# EAGLE schematic master_jorge2 (EAGLE 7.1.0)
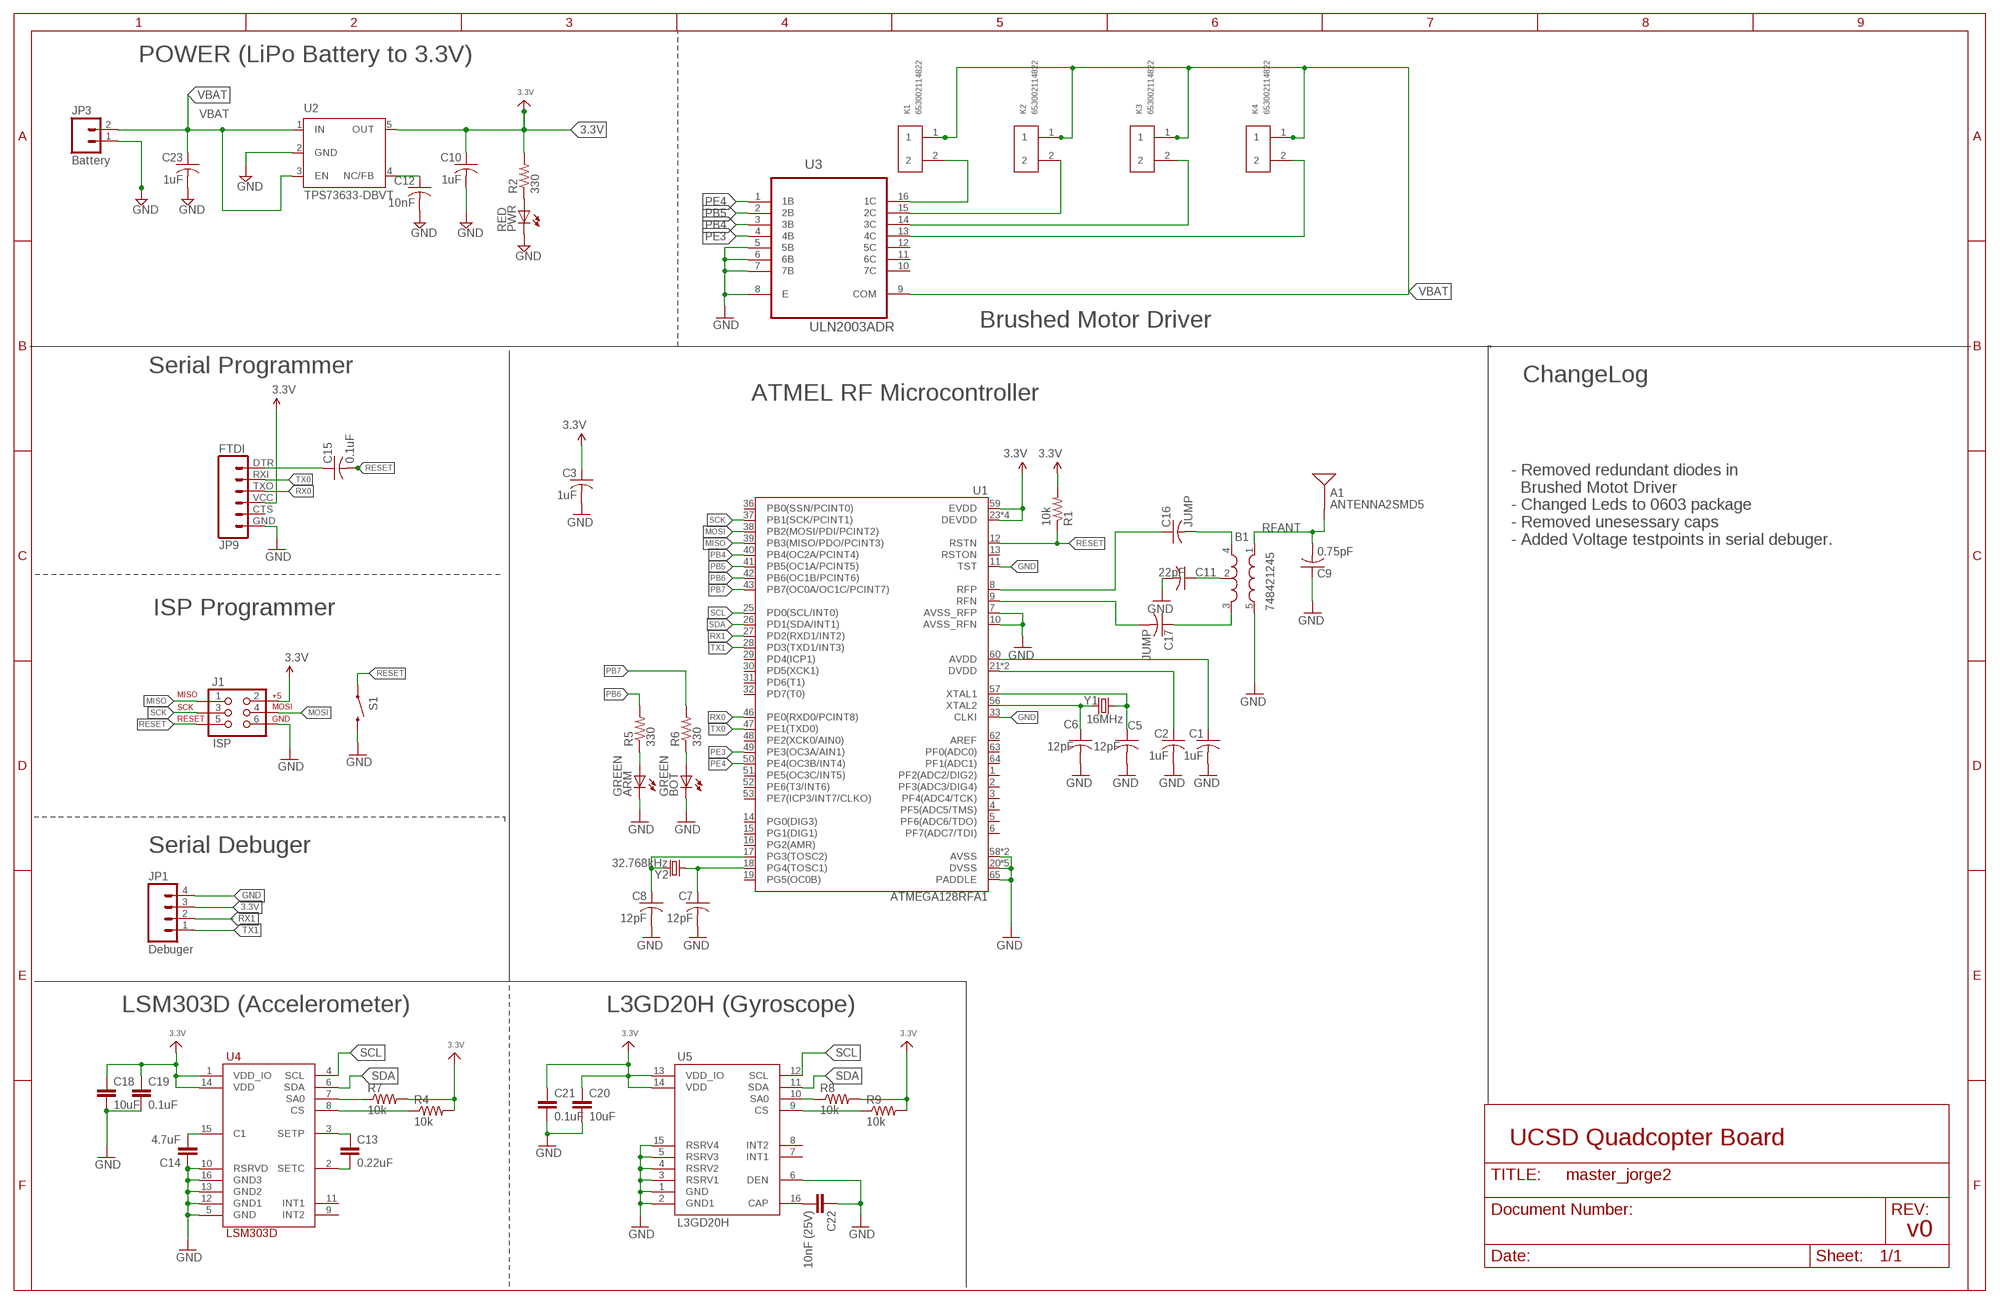
[diagram p0: schematic, sheet 1]

## Parts
A1  ANTENNA2SMD5  [ANTENNA-CHIP5]
ARM  GREEN  LEDCHIPLED_0603  [CHIPLED_0603]
B1  748421245  BALUN0805  [BALUN]
BOT  GREEN  LEDCHIPLED_0603  [CHIPLED_0603]
C1  1uF  C-USC0805  [C0805]
C2  1uF  C-USC0805  [C0805]
C3  1uF  C-USC0805  [C0805]
C5  12pF  C-USC0805  [C0805]
C6  12pF  C-USC0805  [C0805]
C7  12pF  C-USC0805  [C0805]
C8  12pF  C-USC0805  [C0805]
C9  0.75pF  C-USC0805  [C0805]
C10  1uF  C-USC0805  [C0805]
C11  22pF  C-USC0805  [C0805]
C12  10nF  C-USC0805  [C0805]
C13  0.22uF  CAP0805  [0805]
C14  4.7uF  CAP0805  [0805]
C15  0.1uF  C-USC0805  [C0805]
C16  JUMP  C-USC0805  [C0805]
C17  JUMP  C-USC0805  [C0805]
C18  10uF  CAP0805  [0805]
C19  0.1uF  CAP0805  [0805]
C20  10uF  CAP0805  [0805]
C21  0.1uF  CAP0805  [0805]
C22  10nF (25V)  CAP0805  [0805]
C23  1uF  C-USC0805  [C0805]
J1  ISP  AVR_SPI_PRG_6NS  [2X3-NS]
JP1  Debuger  M04PTH  [1X04]
JP3  Battery  M02PTH  [1X02]
JP9  FTDI  FTDI_BASICPTH  [FTDI_BASIC]
K1  653002114822  [653002114822]
K2  653002114822  [653002114822]
K3  653002114822  [653002114822]
K4  653002114822  [653002114822]
PWR  RED  LEDCHIPLED_0603  [CHIPLED_0603]
R1  10k  R-US_R0805  [R0805]
R2  330  R-US_R0805  [R0805]
R4  10k  RESISTOR0805-RES  [0805]
R5  330  R-US_R0805  [R0805]
R6  330  R-US_R0805  [R0805]
R7  10k  RESISTOR0805-RES  [0805]
R8  10k  RESISTOR0805-RES  [0805]
R9  10k  RESISTOR0805-RES  [0805]
S1  SWITCH-MOMENTARY-2SMD  [TACTILE_SWITCH_SMD]
U1  ATMEGA128RFA1  [QFN-64]
U2  TPS73633-DBVT  [SOT23-DBV]
U3  ULN2003ADR  [SOIC127P600X175-16N]
U4  LSM303D  [LGA16_3X3MM]
U5  L3GD20H  [LGA16_3X3MM]
Y1  16MHz  CRYSTAL5X3  [CRYSTAL-SMD-5X3]
Y2  32.768kHz  CRYSTAL32-SMD  [CRYSTAL-32KHZ-SMD]

## Nets
3.3V: C3.1 C10.1 C18.1 C19.1 C20.1 C21.1 J1.2 JP1.3 JP9.VCC R1.2 R2.2 R4.2 R7.2 R8.2 R9.2 U1.23(DEVDD) U1.34(DEVDD) U1.44(DEVDD) U1.54(DEVDD) U1.59(EVDD) U2.5(OUT) U4.1(VDD_IO) U4.14(VDD) U5.13(VDD_IO) U5.14(VDD)
AVDD: C1.1 U1.60(AVDD)
DTR: C15.1 JP9.DTR
DVDD: C2.1 U1.21(DVDD) U1.22(DVDD)
GND: ARM.C B1.5(GND) BOT.C C1.2 C2.2 C3.2 C5.2 C6.2 C7.2 C8.2 C9.1 C10.2 C11.2 C12.2 C14.1 C18.2 C19.2 C20.2 C21.2 C22.1 C23.2 J1.6 JP1.4 JP3.1 JP9.GND PWR.C S1.3 U1.7(AVSS_RFP) U1.10(AVSS_RFN) U1.11(TST) U1.20(DVSS) U1.24(DVSS) U1.33(CLKI) U1.35(DVSS) U1.45(DVSS) U1.55(DVSS) U1.58(AVSS) U1.61(AVSS) U1.65(PADDLE) U2.2(GND) U3.5(5B) U3.6(6B) U3.7(7B) U3.8(E) U4.5(GND) U4.10(RSRVD) U4.12(GND1) U4.13(GND2) U4.16(GND3) U5.1(GND) U5.2(GND1) U5.3(RSRV1) U5.4(RSRV2) U5.5(RSRV3) U5.6(DEN) U5.15(RSRV4)
MISO: J1.1 U1.39(PB3(MISO/PDO/PCINT3))
MOSI: J1.4 U1.38(PB2(MOSI/PDI/PCINT2))
N$1: C12.1 U2.4(NC/FB)
N$2: PWR.A R2.1
N$3: C5.1 U1.57(XTAL1) Y1.3
N$4: C6.1 U1.56(XTAL2) Y1.1
N$5: C7.1 U1.18(PG4(TOSC1)) Y2.X1
N$6: C8.1 U1.17(PG3(TOSC2)) Y2.X2
N$7: B1.2(GND) C11.1
N$8: ARM.A R5.1
N$9: C13.1 U4.3(SETP)
N$10: B1.4(OUT1) C16.2
N$11: B1.3(OUT2) C17.1
N$12: C13.2 U4.2(SETC)
N$13: BOT.A R6.1
N$14: R4.1 U4.8(CS)
N$15: R7.1 U4.7(SA0)
N$16: C14.2 U4.15(C1)
N$17: R8.1 U5.10(SA0)
N$18: R9.1 U5.9(CS)
N$19: C22.2 U5.16(CAP)
N$29: K1.2 U3.16(1C)
N$30: K2.2 U3.15(2C)
N$31: K3.2 U3.14(3C)
N$32: K4.2 U3.13(4C)
PB4: U1.40(PB4(OC2A/PCINT4)) U3.3(3B)
PB5: U1.41(PB5(OC1A/PCINT5)) U3.2(2B)
PB6: R5.2 U1.42(PB6(OC1B/PCINT6))
PB7: R6.2 U1.43(PB7(OC0A/OC1C/PCINT7))
PE3: U1.49(PE3(OC3A/AIN1)) U3.4(4B)
PE4: U1.50(PE4(OC3B/INT4)) U3.1(1B)
RESET: C15.2 J1.5 R1.1 S1.1 U1.12(RSTN)
RFANT [RFSIG]: A1.FEED(SIGNAL) B1.1(IN) C9.2
RFN: C17.2 U1.9(RFN)
RFP: C16.1 U1.8(RFP)
RX0: JP9.TXO U1.46(PE0(RXD0/PCINT8))
RX1: JP1.2 U1.27(PD2(RXD1/INT2))
SCK: J1.3 U1.37(PB1(SCK/PCINT1))
SCL: U1.25(PD0(SCL/INT0)) U4.4(SCL) U5.12(SCL)
SDA: U1.26(PD1(SDA/INT1)) U4.6(SDA) U5.11(SDA)
TX0: JP9.RXI U1.47(PE1(TXD0))
TX1: JP1.1 U1.28(PD3(TXD1/INT3))
VBAT: C23.1 JP3.2 K1.1 K2.1 K3.1 K4.1 U2.1(IN) U2.3(EN) U3.9(COM)
Unconnected: JP9.CTS U1.1(PF2(ADC2/DIG2)) U1.2(PF3(ADC3/DIG4)) U1.3(PF4(ADC4/TCK)) U1.4(PF5(ADC5/TMS)) U1.5(PF6(ADC6/TDO)) U1.6(PF7(ADC7/TDI)) U1.13(RSTON) U1.14(PG0(DIG3)) U1.15(PG1(DIG1)) U1.16(PG2(AMR)) U1.19(PG5(OC0B)) U1.29(PD4(ICP1)) U1.30(PD5(XCK1)) U1.31(PD6(T1)) U1.32(PD7(T0)) U1.36(PB0(SSN/PCINT0)) U1.48(PE2(XCK0/AIN0)) U1.51(PE5(OC3C/INT5)) U1.52(PE6(T3/INT6)) U1.53(PE7(ICP3/INT7/CLKO)) U1.62(AREF) U1.63(PF0(ADC0)) U1.64(PF1(ADC1)) U3.10(7C) U3.11(6C) U3.12(5C) U4.9(INT2) U4.11(INT1) U5.7(INT1) U5.8(INT2)

## Notes on the sheet
- POWER (LiPo Battery to 3.3V)
- Brushed Motor Driver
- Serial Programmer
- ChangeLog
- ATMEL RF Microcontroller
- - Removed redundant diodes in 
    Brushed Motot Driver
  - Changed Leds to 0603 package
  - Removed unesessary caps
  - Added Voltage testpoints in serial debuger.
- ISP Programmer
- Serial Debuger
- LSM303D (Accelerometer) | L3GD20H (Gyroscope)
- UCSD Quadcopter Board
- v0

## Library data of the parts
A1 = SparkFun-RF:ANTENNA2: Chip antenna Single endded antenna. Common with smaller chip antennas. CHIP4 package is the GPS Chip Antenna SKU: GPS-08418. CHIP5 package is 2.4GHz chip antenna SKU: WRL-00144.
ARM BOT PWR = led:LED: LED OSRAM: - CHIPLED LG R971, LG N971, LY N971, LG Q971, LY Q971, LO R971, LY R971 LH N974, LH R974 LS Q976, LO Q976, LY Q976 LO Q996 - Hyper CHIPLED LW Q18S LB Q993, LB Q99A, LB R99A - SideLED LS A670, LO A670, LY A670, LG A670, LP A670 LB A673, LV A673, LT A673, LW A673 LH A674 LY A675 LS A676, LA A676, LO A676, LY A676, LW A676 LS A679, LY A679, LG A679 - Hyper Micro SIDELED® LS Y876, LA Y876, LO Y876, LY Y876 LT Y87S - SmartLED LW L88C, LW L88S LB L89C, LB L89S, LG L890 LS L89K, LO L89K, LY L89K LS L896, LA L896, LO L896, LY L896 - TOPLED LS T670, LO T670, LY T670, LG T670, LP T670 LSG T670, LSP T670, LSY T670, LOP T670, LYG T670 LG T671, LOG T671, LSG T671 LB T673, LV T673, LT T673, LW T673 LH T674 LS T676, LA T676, LO T676, LY T676, LB T676, LH T676, LSB T676, LW T676 LB T67C, LV T67C, LT T67C, LS T67K, LO T67K, LY T67K, LW E67C LS E67B, LA E67B, LO E67B, LY E67B, LB E67C, LV E67C, LT E67C LW T67C LS T679, LY T679, LG T679 LS T770, LO T770, LY T770, LG T770, LP T770 LB T773, LV T773, LT T773, LW T773 LH T774 LS E675, LA E675, LY E675, LS T675 LS T776, LA T776, LO T776, LY T776, LB T776 LHGB T686 LT T68C, LB T68C - Hyper Mini TOPLED® LB M676 - Mini TOPLED Santana® LG M470 LS M47K, LO M47K, LY M47K Source: http://www.osram.convergy.de LUXEON: - LUMILED® LXK2-PW12-R00, LXK2-PW12-S00, LXK2-PW14-U00, LXK2-PW14-V00 LXK2-PM12-R00, LXK2-PM12-S00, LXK2-PM14-U00 LXK2-PE12-Q00, LXK2-PE12-R00, LXK2-PE12-S00, LXK2-PE14-T00, LXK2-PE14-U00 LXK2-PB12-K00, LXK2-PB12-L00, LXK2-PB12-M00, LXK2-PB14-N00, LXK2-PB14-P00, LXK2-PB14-Q00 LXK2-PR12-L00, LXK2-PR12-M00, LXK2-PR14-Q00, LXK2-PR14-R00 LXK2-PD12-Q00, LXK2-PD12-R00, LXK2-PD12-S00 LXK2-PH12-R00, LXK2-PH12-S00 LXK2-PL12-P00, LXK2-PL12-Q00, LXK2-PL12-R00 Source: www.luxeon.com KINGBRIGHT: KA-3528ASYC Source: www.kingbright.com
B1 = SparkFun-RF:BALUN: 0805 footprint balun- Ember 351/357
C1-C3 C5-C12 C15-C17 C23 = resistor:C-US: CAPACITOR, American symbol
C13 C14 C18-C22 = SparkFun-Capacitors:CAP: Capacitor Standard 0603 ceramic capacitor, and 0.1" leaded capacitor.
J1 = SparkFun-Connectors:AVR_SPI_PRG_6: AVR ISP 6 Pin This is the reduced ISP connector for AVR programming. Common on Arduino. This footprint will take up less PCB space and can be used with a 10-pin to 6-pin adapter such as SKU: BOB-08508
JP1 = SparkFun-Connectors:M04: Header 4 Standard 4-pin 0.1" header. Use with straight break away headers (SKU : PRT-00116), right angle break away headers (PRT-00553), swiss pins (PRT-00743), machine pins (PRT-00117), and female headers (PRT-00115). Molex polarized connector foot print use with SKU : PRT-08231 with associated crimp pins and housings. 1MM SMD Version SKU: PRT-10208
JP3 = SparkFun:M02: Header 2 Standard 2-pin 0.1" header. Use with straight break away headers (SKU : PRT-00116), right angle break away headers (PRT-00553), swiss pins (PRT-00743), machine pins (PRT-00117), and female headers (PRT-00115). Molex polarized connector foot print use with SKU : PRT-08233 with associated crimp pins and housings.
JP9 = SparkFun-Connectors:FTDI_BASIC: FTDI Basic header with labels
K1-K4 = Wuerth_Elektronik_eiCan_Wire_to_Board_Connectors:653002114822: WR-WTB 1.25mm Male Vertical Shrouded Header, 2 Pins=>Code : Con_WTB_1.25_PCB_THT_653002114822 <http://katalog.we-online.de/media/thumbs2/eican/thb_Con_WTB_1.25_PCB_THT_6530xx114822_pf2.jpg> Details see: http://katalog.we-online.de/en/em/653_0xx_114_822 Created 2014-06-06, Karrer Zheng 2014 (C) Würth Elektronik; OC_FARNELL: unknown
R1 R2 R5 R6 = resistor:R-US_: RESISTOR, American symbol
R4 R7-R9 = SparkFun-Passives:RESISTOR: Resistor Basic schematic elements and footprints for 0603, 1206, and PTH resistors.
S1 = SparkFun-Electromechanical:SWITCH-MOMENTARY-2: Various NO switches- pushbuttons, reed, etc
U1 = SparkFun-DigitalIC:ATMEGA128RFA1: ATmega128RFA1 8-bit AVR Microcontroller with Low Power 2.4GHz Transceiver for ZigBee and IEEE 802.15.4
U2 = Power:TPS73633-DBVT
U3 = Texas Instruments_By_element14_Batch_1:ULN2003ADR: 8-BIT SHIFT REGISTERS WITH 3-STATE OUTPUT REGISTERS; MPN: ULN2003ADR; OC_FARNELL: 1470513; OC_NEWARK: 77C3560; PACKAGE: SOIC-16; SUPPLIER: TEXAS INSTRUMENTS
U4 = IMU_parts:LSM303D
U5 = IMU_parts:L3GD20H
Y1 Y2 = SparkFun-FreqCtrl:CRYSTAL: Various standard crystals. Proven footprints. Spark Fun Electronics SKU : COM-00534

## Net classes
1 RFSIG: width 0.457 mm, clearance 0.205 mm to class 0, clearance 0.205 mm